# Altium schematic sheet POWER_SUPPLY.SchDoc: ATLAS_XP2V5
size 558 x 431 mm; Organization: IMP Automatika d.o.o.; Revision: V5
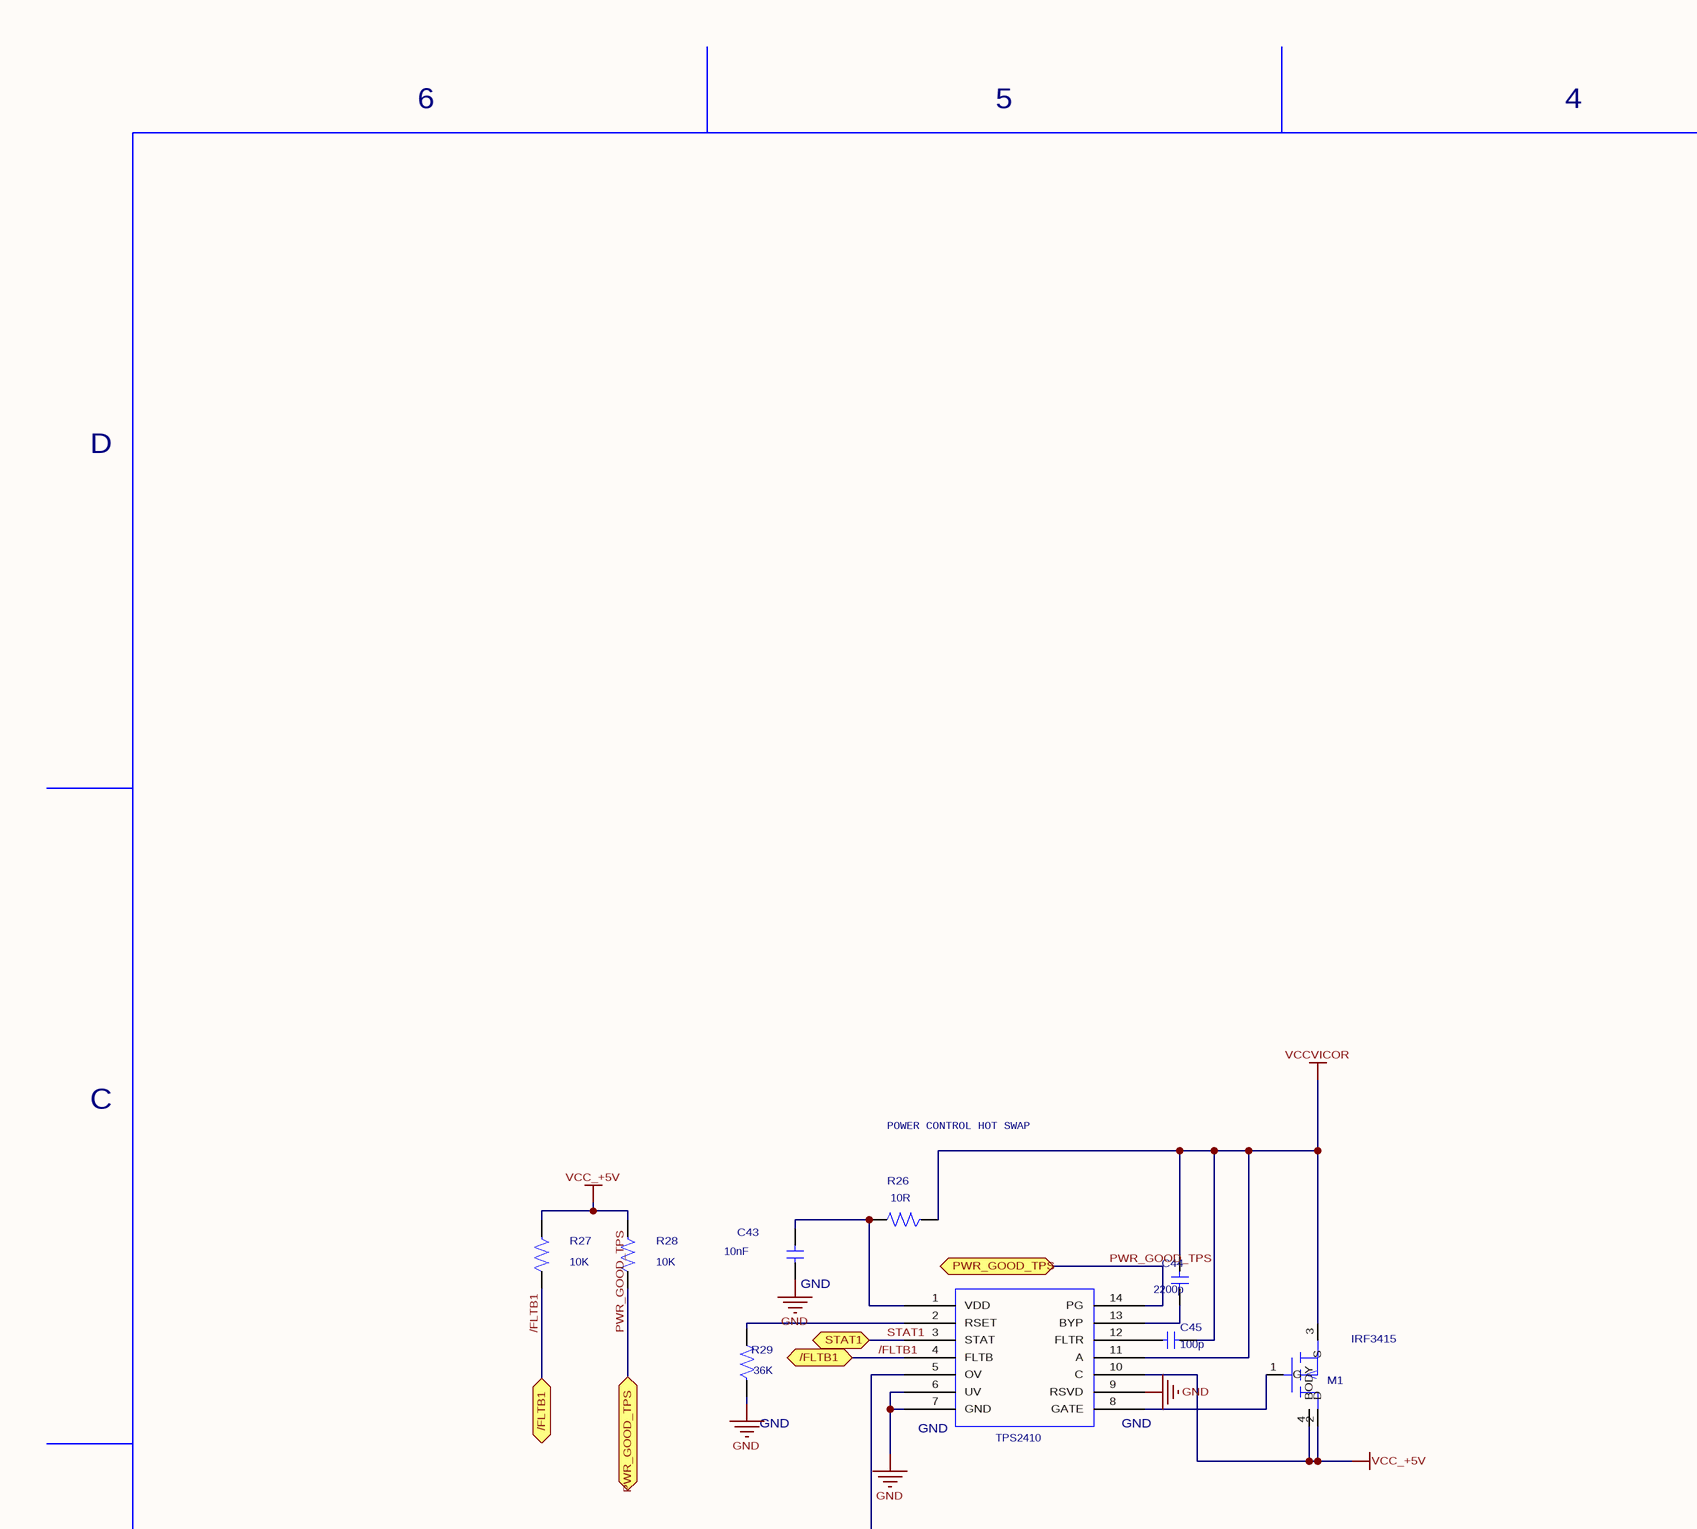
[diagram p0: POWER_SUPPLY.SchDoc, top left]
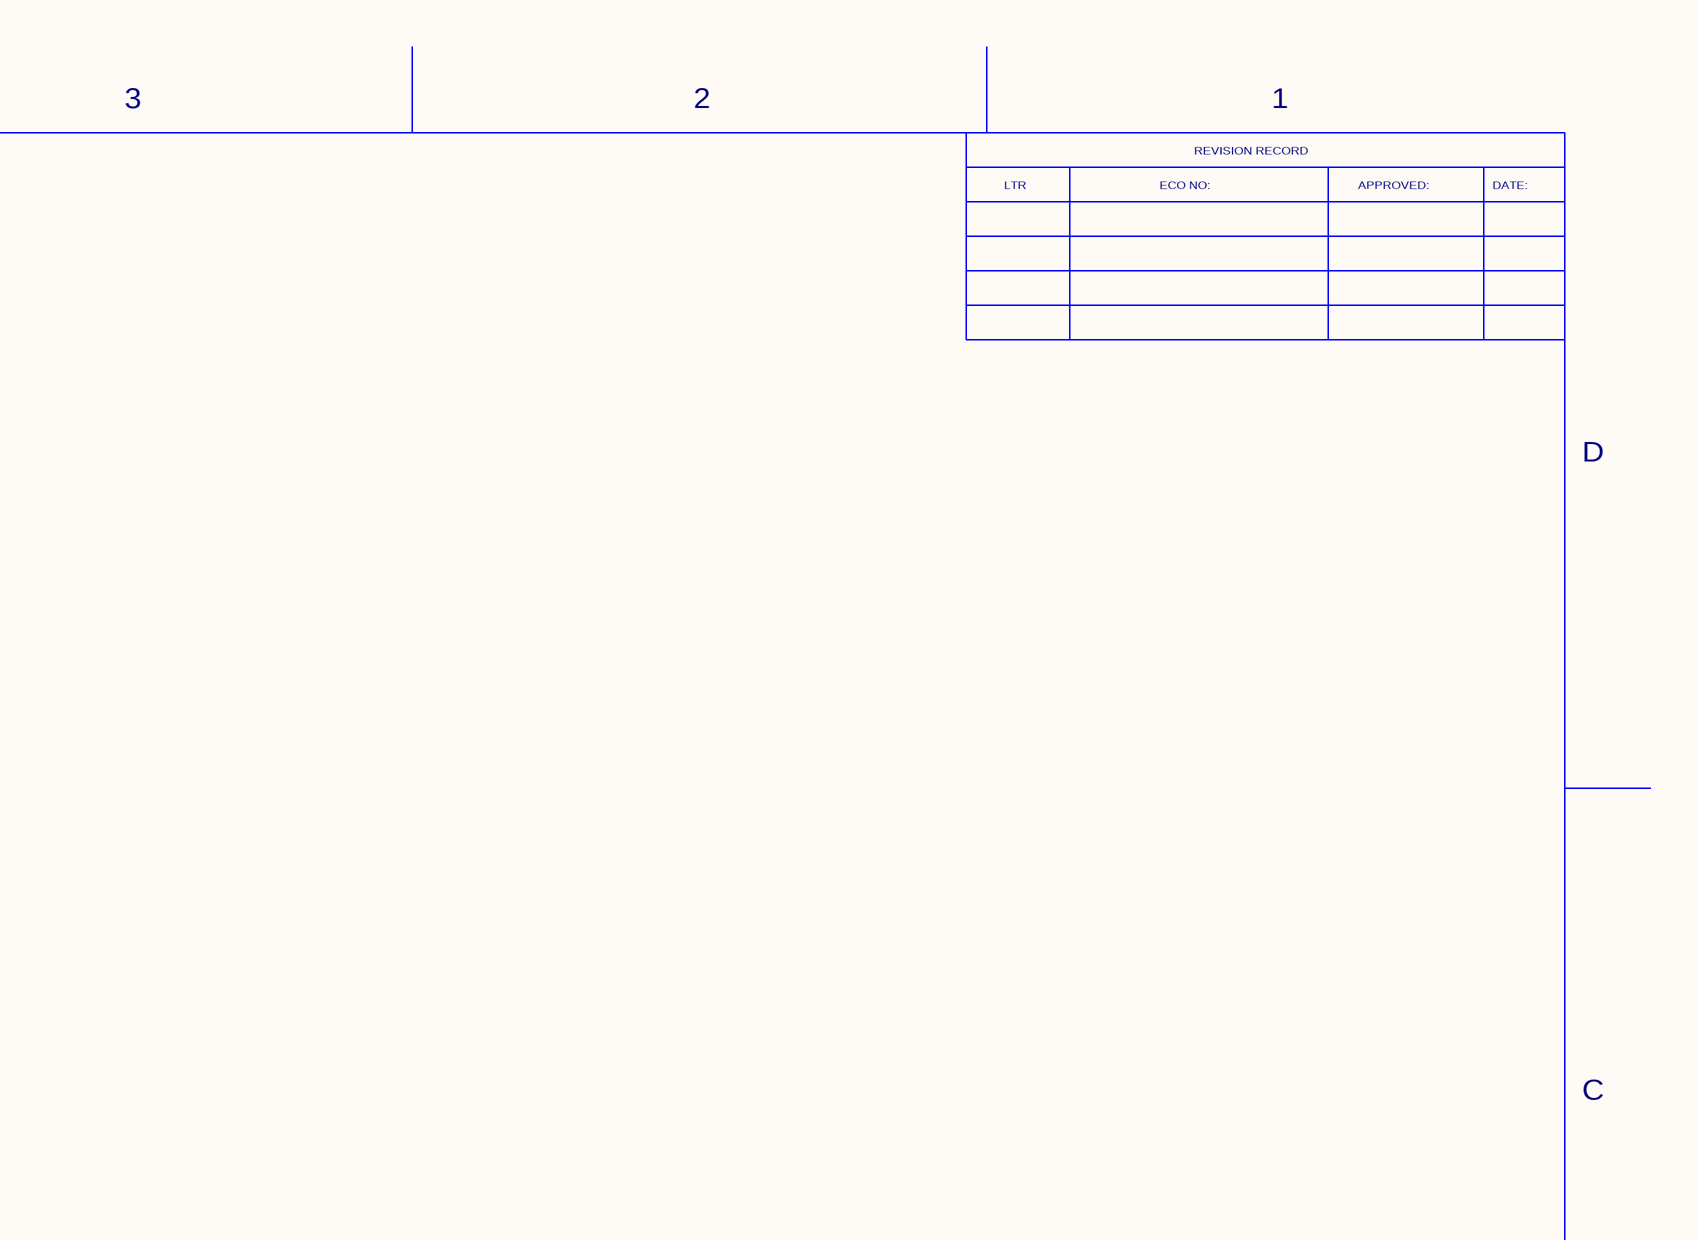
[diagram p1: POWER_SUPPLY.SchDoc, top right]
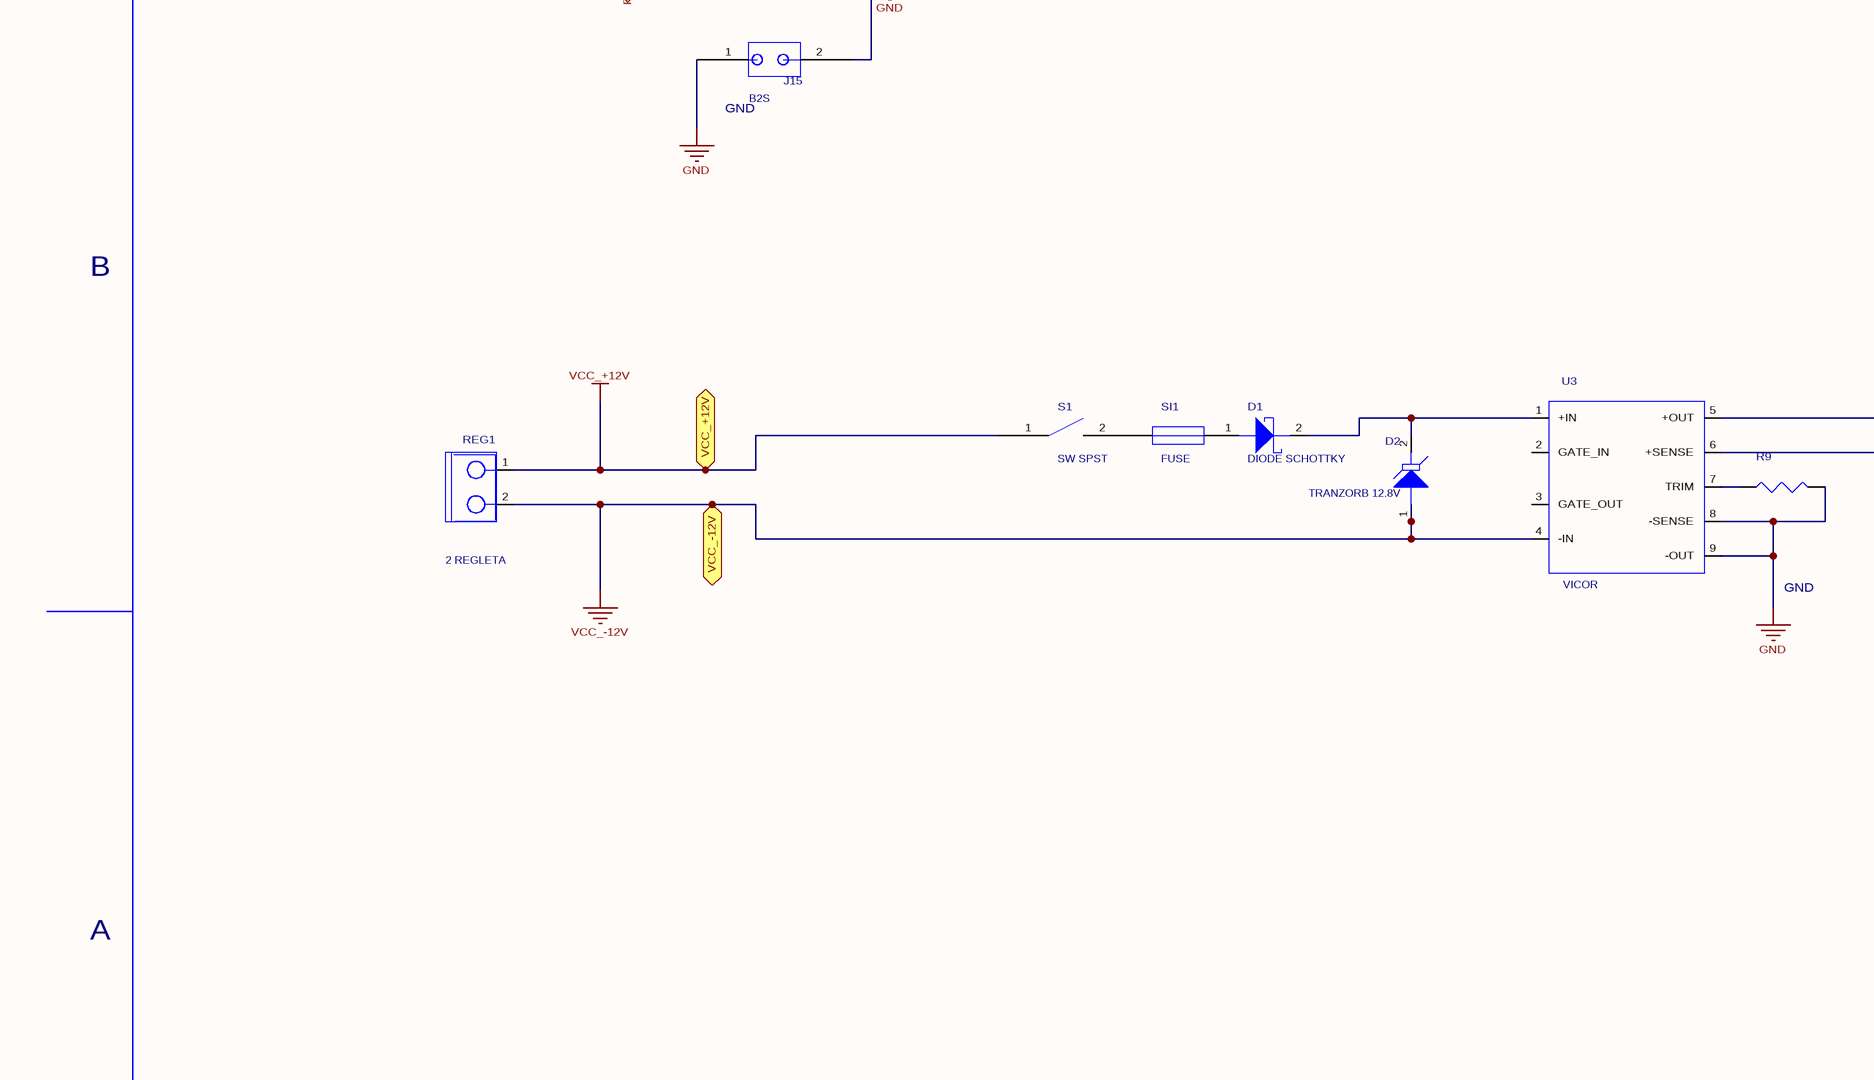
[diagram p2: POWER_SUPPLY.SchDoc, bottom left]
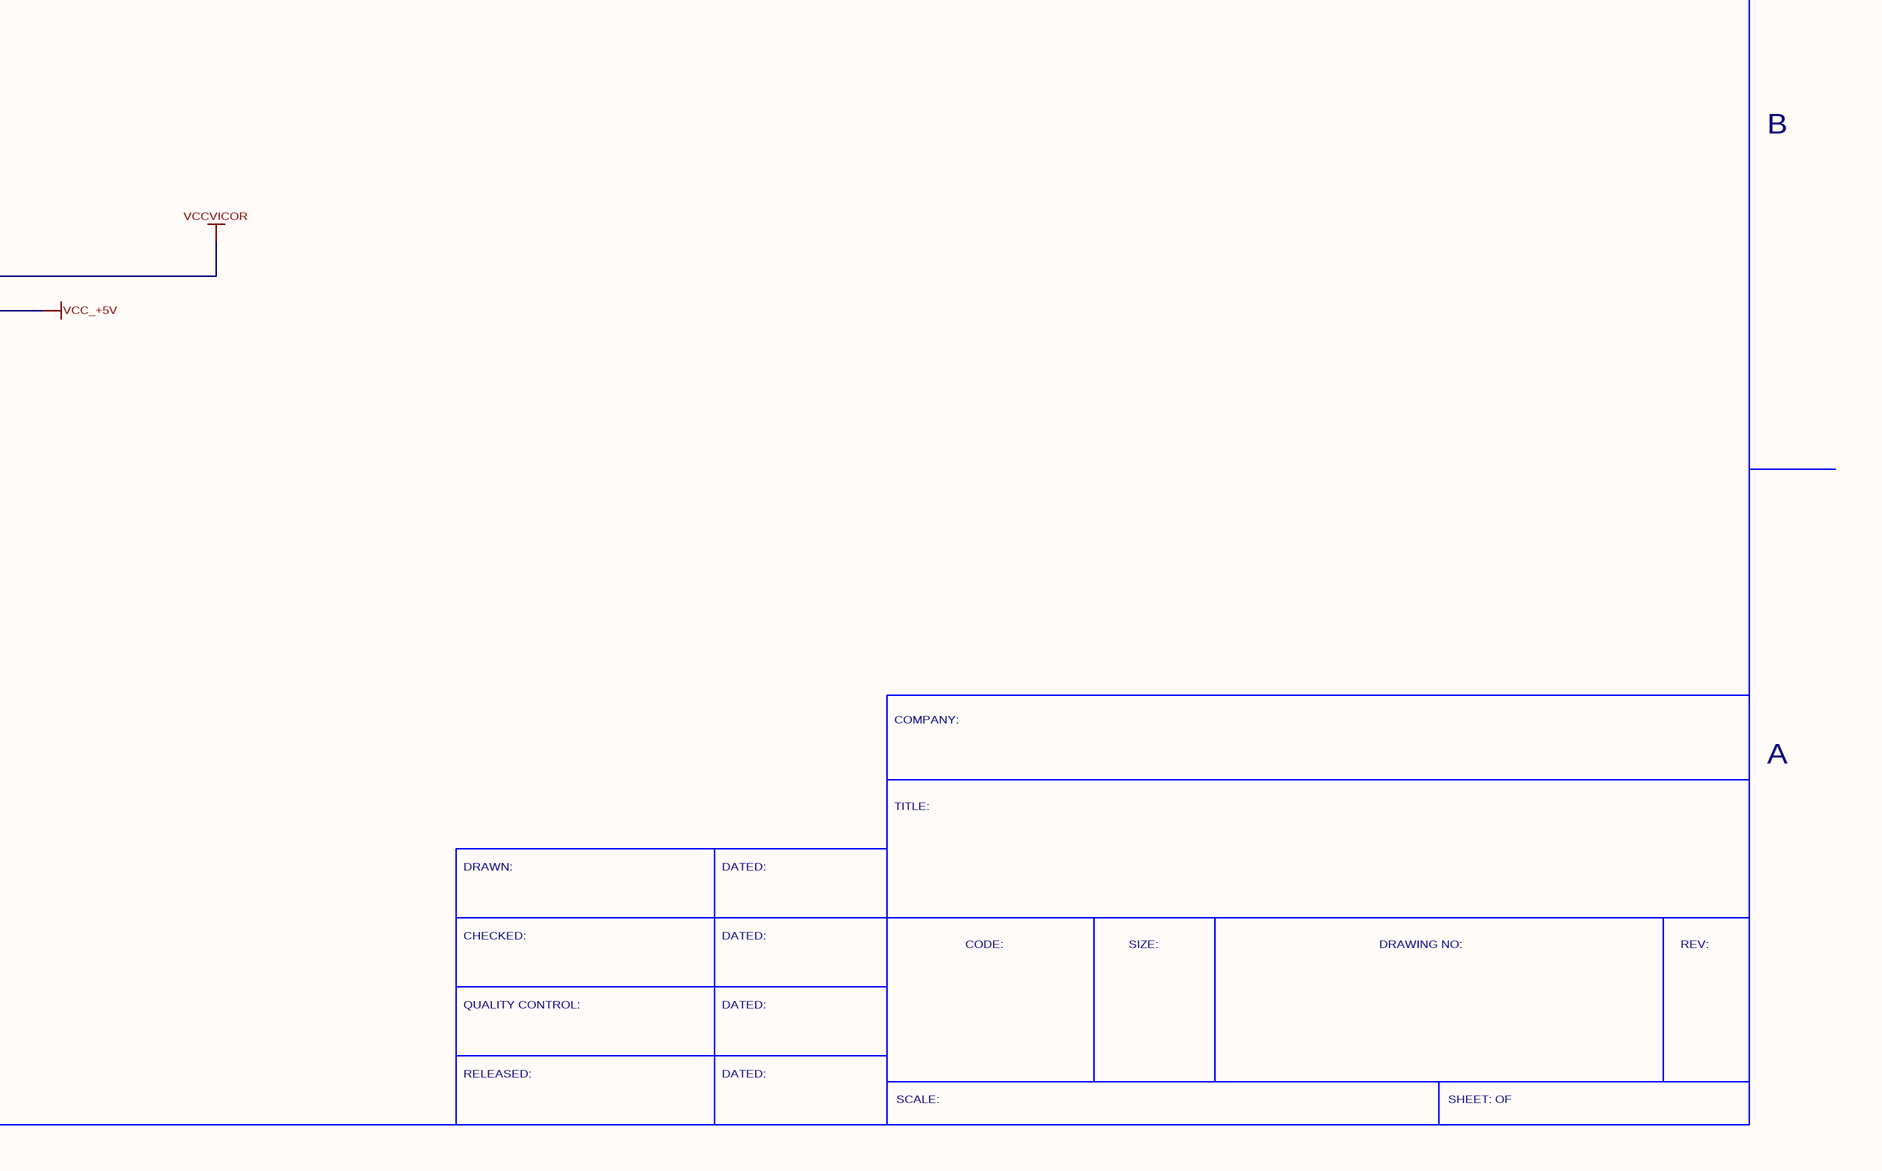
[diagram p3: POWER_SUPPLY.SchDoc, bottom right]

## Parts
C43  value 10nF  [SM/C_0805]  (hidden comment: C_3)
C44  value 2200p  [SM/C_0805]  (hidden comment: C_3)
C45  value 100p  [SM/C_0805]  (hidden comment: C_3)
D1  value DIODE SCHOTTKY  [SM/DO214AB_21]  (hidden comment: DIODE_SCHOTTKY_0)
D2  value TRANZORB 12.8V  [SM/DO214AC_21]  (hidden comment: TRANZORB_0)
J15  value B2S  [JUMPER_100]  (hidden comment: B2S_0)
M1  value IRF3415  [IRF3415_PADS_REV1]  (hidden comment: IRF3415_BODY)
R9  RESISTOR  [SM/R_1206]  (value not drawn)
R26  value 10R  [SM/R_1206]  (hidden comment: R)
R27  value 10K  [SM/R_1206]  (hidden comment: R)
R28  value 10K  [SM/R_1206]  (hidden comment: R)
R29  value 36K  [SM/R_1206]  (hidden comment: R)
REG1  value 2 REGLETA  [REG2_REV8]  (hidden comment: 8_REGLETA_4)
S1  value SW SPST  [SW12V_REV2]  (hidden comment: SW_SPST_0)
SI1  FUSE  [FUSEHOLDER3]
U3  VICOR  [VIKOR1]
U14  value TPS2410  [PDSO-G14_REV7]  (hidden comment: TPS2410_1)

## Ports
/FLTB1 (bidir), PWR_GOOD_TPS (bidir), STAT1 (bidir), VCC_+12V (bidir), VCC_-12V (bidir)

## Nets
GND: C43.1 J15.1 R9.2 R29.1 U3.8(-SENSE) U3.9(-OUT) U14.6(UV) U14.7(GND) U14.9(RSVD)
VCC_+5V: M1.2(D) M1.4(BODY) R27.1 R28.1 U3.6(+SENSE) U14.10(C)
VCC_+12V: REG1.1 S1.1(COMMON) ; port VCC_+12V
VCC_-12V: D2.1(ANODE) REG1.2 U3.4(-IN) ; port VCC_-12V
VCCVICOR: C44.2 C45.1 M1.3(S) R26.1 U3.5(+OUT) U14.11(A)
/FLTB1: R27.2 U14.4(FLTB) ; port /FLTB1
PWR_GOOD_TPS: R28.2 U14.14(PG) ; port PWR_GOOD_TPS
STAT1: U14.3(STAT) ; port STAT1
NetC43_2: C43.2 R26.2 U14.1(VDD)
NetC44_1: C44.1 U14.13(BYP)
NetC45_2: C45.2 U14.12(FLTR)
NetD1_1: D1.1(ANODE) SI1.2
NetD1_2: D1.2(CATHODE) D2.2(CATHODE) U3.1(+IN)
NetJ15_2: J15.2 U14.5(OV)
NetM1_1: M1.1(G) U14.8(GATE)
NetR9_1: R9.1 U3.7(TRIM)
NetR29_2: R29.2 U14.2(RSET)
NetS1_2: S1.2(NO) SI1.1

Not connected (* = marked no-connect by the designer): U3 2(GATE_IN) 3(GATE_OUT)

## Notes on the sheet
- 6
- 5
- 4
- 3
- 2
- 1
- LTR
- ECO NO:
- REVISION RECORD
- APPROVED:
- DATE:
- D
- C
- POWER CONTROL HOT SWAP
- (near C43) GND
- (near R29) GND
- (near U14) GND
- (near J15) GND
- B
- GND
- COMPANY:
- A
- TITLE:
- DRAWN:
- DATED:
- CHECKED:
- CODE:
- SIZE:
- DRAWING NO:
- REV:
- QUALITY CONTROL:
- RELEASED:
- SCALE:
- SHEET: OF

## Library data of the parts
C43 = C_3: COMPSIDE: TOP; COMPLOC: [-4300.000,200.000]; COMPROT: 0; COMPFIXED: NO; COMPHEIGHT: 0.000; Source_Path: C:\ORCAD\ORCAD_10.0\TOOLS\CAPTURE\LIBRARY\PSPICE\ANALOG.OLB; DIST: FLAT; PSpiceTemplate: C^@REFDES %1 %2 ?TOLERANCE|C^@REFDES| @VALUE ?IC/IC=@IC/ ?TOLERANCE|\n.model C^@REFDES CAP C=1 DEV=@TOLERANCE%|; VOLTAGE: CMAX; CURRENT: CIMAX; KNEE: CBMAX; SLOPE: CSMAX; MAX_TEMP: CTMAX; COMPGROUP: 0; COMPLOCKED: NO; COMPKEY: NO; DECOUPLER: NO; MEMORY: NO; PCB DECAL: SM/C_0805
C44 = C_3: COMPSIDE: TOP; COMPLOC: [-3400.000,200.000]; COMPROT: 0; COMPFIXED: NO; COMPHEIGHT: 0.000; Source_Path: C:\ORCAD\ORCAD_10.0\TOOLS\CAPTURE\LIBRARY\PSPICE\ANALOG.OLB; DIST: FLAT; PSpiceTemplate: C^@REFDES %1 %2 ?TOLERANCE|C^@REFDES| @VALUE ?IC/IC=@IC/ ?TOLERANCE|\n.model C^@REFDES CAP C=1 DEV=@TOLERANCE%|; VOLTAGE: CMAX; CURRENT: CIMAX; KNEE: CBMAX; SLOPE: CSMAX; MAX_TEMP: CTMAX; PCB DECAL: SM/C_0805; COMPGROUP: 0; COMPLOCKED: NO; COMPKEY: NO; DECOUPLER: NO; MEMORY: NO
C45 = C_3: COMPHEIGHT: 0.000; MEMORY: NO; COMPGROUP: 0; COMPLOC: [-3700.000,200.000]; COMPSIDE: TOP; Source_Path: C:\ORCAD\ORCAD_10.0\TOOLS\CAPTURE\LIBRARY\PSPICE\ANALOG.OLB; DIST: FLAT; PSpiceTemplate: C^@REFDES %1 %2 ?TOLERANCE|C^@REFDES| @VALUE ?IC/IC=@IC/ ?TOLERANCE|\n.model C^@REFDES CAP C=1 DEV=@TOLERANCE%|; VOLTAGE: CMAX; CURRENT: CIMAX; KNEE: CBMAX; SLOPE: CSMAX; MAX_TEMP: CTMAX; DECOUPLER: NO; COMPKEY: NO; COMPLOCKED: NO; COMPFIXED: NO; COMPROT: 0; PCB DECAL: SM/C_0805
D1 = DIODE_SCHOTTKY_0: Source_Path: C:\CADENCE\PSD_15.1\TOOLS\ATLAS_ITA\ATLAS_ITA.DSN; PCB DECAL: SM/DO214AB_21
D2 = TRANZORB_0: Source_Path: C:\CADENCE\PSD_15.1\TOOLS\ATLAS_ITA\ATLAS_ITA.DSN; PCB DECAL: SM/DO214AC_21
J15 = B2S_0: Source_Path: C:\CADENCE\PSD_15.1\TOOLS\ATLAS_ITA\ATLAS_ITA.DSN; PCB DECAL: JUMPER_100
M1 = IRF3415_BODY: COMPSIDE: TOP; COMPLOC: [-1200.000,2000.000]; COMPROT: 0; COMPFIXED: NO; COMPHEIGHT: 0.000; Source_Path: C:\CADENCE\PSD_15.1\TOOLS\ATLAS_ITA\ATLAS_ITA.DSN; PSpiceTemplate: M^@REFDES %d %g %s %s @MODEL; COMPGROUP: 0; COMPLOCKED: NO; COMPKEY: NO; DECOUPLER: NO; MEMORY: NO; Implementation: IRF3415; PCB DECAL: IRF3415_PADS_REV1
R9 = RESISTOR: Source_Path: C:\PROGRAM FILES\ORCAD\CAPTURE\LIBRARY\DISCRETE.OLB; PCB DECAL: SM/R_1206; Value: RESISTOR
R26 = R: COMPSIDE: TOP; COMPLOC: [-2400.000,2400.000]; COMPROT: 0; COMPFIXED: NO; COMPHEIGHT: 0.000; Source_Path: C:\ORCAD\ORCAD_10.0\TOOLS\CAPTURE\LIBRARY\PSPICE\ANALOG.OLB; DIST: FLAT; PSpiceTemplate: R^@REFDES %1 %2 ?TOLERANCE|R^@REFDES| @VALUE  ?TOLERANCE|\n.model R^@REFDES RES R=1 DEV=@TOLERANCE%|; VOLTAGE: RVMAX; SLOPE: RSMAX; MAX_TEMP: RTMAX; POWER: RMAX; COMPGROUP: 0; COMPLOCKED: NO; COMPKEY: NO; DECOUPLER: NO; MEMORY: NO; PCB DECAL: SM/R_1206
R27 R28 = R: Source_Path: C:\ORCAD\ORCAD_10.0\TOOLS\CAPTURE\LIBRARY\PSPICE\ANALOG.OLB; DIST: FLAT; PSpiceTemplate: R^@REFDES %1 %2 ?TOLERANCE|R^@REFDES| @VALUE  ?TOLERANCE|\n.model R^@REFDES RES R=1 DEV=@TOLERANCE%|; VOLTAGE: RVMAX; SLOPE: RSMAX; MAX_TEMP: RTMAX; POWER: RMAX; PCB DECAL: SM/R_1206
R29 = R: COMPHEIGHT: 0.000; MEMORY: NO; COMPGROUP: 0; COMPLOC: [-2400.000,2400.000]; COMPSIDE: TOP; Source_Path: C:\ORCAD\ORCAD_10.0\TOOLS\CAPTURE\LIBRARY\PSPICE\ANALOG.OLB; DIST: FLAT; PSpiceTemplate: R^@REFDES %1 %2 ?TOLERANCE|R^@REFDES| @VALUE  ?TOLERANCE|\n.model R^@REFDES RES R=1 DEV=@TOLERANCE%|; VOLTAGE: RVMAX; SLOPE: RSMAX; MAX_TEMP: RTMAX; POWER: RMAX; DECOUPLER: NO; COMPKEY: NO; COMPLOCKED: NO; COMPFIXED: NO; COMPROT: 0; PCB DECAL: SM/R_1206
REG1 = 8_REGLETA_4: Source_Path: E:\MILOS\PROJECTS\ATLAS_XP\ATLAS_XP.DSN; SDTSourceLibName: C:\WINDOWS\TEMP\ATP_00.LIB; PCB DECAL: REG2_REV8
S1 = SW_SPST_0: Source_Path: C:\CADENCE\PSD_15.1\TOOLS\ATLAS_ITA\ATLAS_ITA.DSN; PCB DECAL: SW12V_REV2
SI1 = FUSE: Source_Path: C:\CADENCE\PSD_15.1\TOOLS\CAPTURE\LIBRARY\IEC\DEVICE.OLB; PCB DECAL: FUSEHOLDER3; Value: FUSE
U3 = VICOR: Source_Path: C:\DOCUMENTS AND SETTINGS\RAYVOJ HARDWAREA\DESKTOP\MILOSH.OLB; PCB DECAL: VIKOR1; Value: VICOR
U14 = TPS2410_1: FPLIST: DIP.100B/14/W.300/L.800; COMPSIDE: TOP; COMPLOC: [-700.000,900.000]; COMPROT: 0; COMPFIXED: NO; COMPHEIGHT: 0.000; Source_Path: C:\ORCAD\PROJECTS\PUPINATPPCB.DSN; PCB DECAL: PDSO-G14_REV7; COMPGROUP: 0; COMPLOCKED: NO; COMPKEY: NO; DECOUPLER: NO; MEMORY: NO